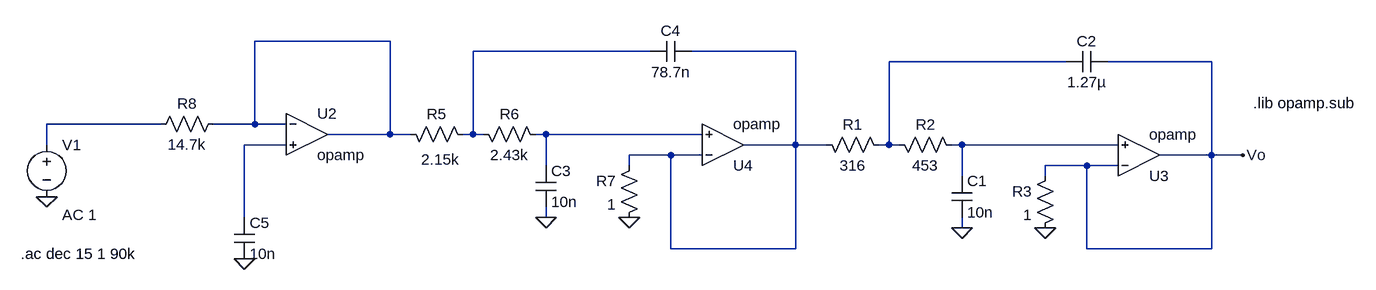
[diagram p0: schematic low_pass_filter.asc]
low_pass_filter.asc, the LTspice schematic file:
Version 4.1
SHEET 1 880 680
WIRE -672 -256 -880 -256
WIRE -272 -240 -544 -240
WIRE -48 -240 -208 -240
WIRE 368 -224 96 -224
WIRE 592 -224 432 -224
WIRE -1024 -128 -1200 -128
WIRE -880 -128 -880 -256
WIRE -880 -128 -944 -128
WIRE -832 -128 -880 -128
WIRE -672 -112 -672 -256
WIRE -672 -112 -768 -112
WIRE -640 -112 -672 -112
WIRE -544 -112 -544 -240
WIRE -544 -112 -560 -112
WIRE -528 -112 -544 -112
WIRE -432 -112 -448 -112
WIRE -192 -112 -432 -112
WIRE -1200 -96 -1200 -128
WIRE -832 -96 -896 -96
WIRE -48 -96 -48 -240
WIRE -48 -96 -128 -96
WIRE 0 -96 -48 -96
WIRE 96 -96 96 -224
WIRE 96 -96 80 -96
WIRE 112 -96 96 -96
WIRE 208 -96 192 -96
WIRE 448 -96 208 -96
WIRE -240 -80 -304 -80
WIRE -192 -80 -240 -80
WIRE 592 -80 592 -224
WIRE 592 -80 512 -80
WIRE 640 -80 592 -80
WIRE -432 -64 -432 -112
WIRE -304 -64 -304 -80
WIRE 400 -64 336 -64
WIRE 448 -64 400 -64
WIRE 208 -48 208 -96
WIRE 336 -48 336 -64
WIRE -896 16 -896 -96
WIRE -432 16 -432 0
WIRE 208 32 208 16
WIRE -240 64 -240 -80
WIRE -48 64 -48 -96
WIRE -48 64 -240 64
WIRE 400 64 400 -64
WIRE 592 64 592 -80
WIRE 592 64 400 64
FLAG 208 32 0
FLAG 336 32 0
FLAG -432 16 0
FLAG -304 16 0
FLAG -1200 -16 0
FLAG 640 -80 Vo
FLAG -896 80 0
SYMBOL res 96 -80 M270
WINDOW 0 32 56 VTop 2
WINDOW 3 0 56 VBottom 2
SYMATTR InstName R1
SYMATTR Value 316
SYMBOL res 208 -80 M270
WINDOW 0 32 56 VTop 2
WINDOW 3 0 56 VBottom 2
SYMATTR InstName R2
SYMATTR Value 453
SYMBOL res 352 -64 M0
SYMATTR InstName R3
SYMATTR Value 1
SYMBOL cap 192 16 M180
WINDOW 0 24 56 Left 2
WINDOW 3 24 8 Left 2
SYMATTR InstName C1
SYMATTR Value 10n
SYMBOL cap 432 -208 M270
WINDOW 0 32 32 VTop 2
WINDOW 3 0 32 VBottom 2
SYMATTR InstName C2
SYMATTR Value 1.27µ
SYMBOL res -544 -96 M270
WINDOW 0 32 56 VTop 2
WINDOW 3 -7 50 VBottom 2
SYMATTR InstName R5
SYMATTR Value 2.15k
SYMBOL res -432 -96 M270
WINDOW 0 32 56 VTop 2
WINDOW 3 0 56 VBottom 2
SYMATTR InstName R6
SYMATTR Value 2.43k
SYMBOL res -288 -80 M0
SYMATTR InstName R7
SYMATTR Value 1
SYMBOL cap -448 0 M180
WINDOW 0 24 56 Left 2
WINDOW 3 24 8 Left 2
SYMATTR InstName C3
SYMATTR Value 10n
SYMBOL cap -208 -224 M270
WINDOW 0 32 32 VTop 2
WINDOW 3 0 32 VBottom 2
SYMATTR InstName C4
SYMATTR Value 78.7n
SYMBOL OpAmps\\opamp 480 -16 M180
SYMATTR InstName U3
SYMBOL OpAmps\\opamp -160 -32 M180
SYMATTR InstName U4
SYMBOL voltage -1200 -112 R0
WINDOW 123 24 124 Left 2
WINDOW 39 0 0 Left 0
SYMATTR Value2 AC 1
SYMATTR InstName V1
SYMATTR Value ""
SYMBOL OpAmps\\opamp -800 -176 R0
SYMATTR InstName U2
SYMBOL res -928 -144 R90
WINDOW 0 0 56 VBottom 2
WINDOW 3 32 56 VTop 2
SYMATTR InstName R8
SYMATTR Value 14.7k
SYMBOL cap -912 16 R0
SYMATTR InstName C5
SYMATTR Value 10n
TEXT 656 -160 Left 2 !.lib opamp.sub
TEXT -1240 72 Left 2 !.ac dec 15 1 90k

The netlist it stands for:
* low_pass_filter.asc
R1 N004 N003 316
R2 N008 N004 453
R3 Vo 0 1
C1 0 N008 10n
C2 Vo N004 1.27µ
R5 N002 N001 2.15k
R6 N006 N002 2.43k
R7 N003 0 1
C3 0 N006 10n
C4 N003 N002 78.7n
X§U3 Vo N008 Vo opamp Aol=100K GBW=10Meg  ; pins invin noninvin out
X§U4 N003 N006 N003 opamp Aol=100K GBW=10Meg  ; pins invin noninvin out
V1 N005 0 AC 1
X§U2 N001 N007 N001 opamp Aol=100K GBW=10Meg  ; pins invin noninvin out
R8 N001 N005 14.7k
C5 N007 0 10n
.lib opamp.sub
.ac dec 15 1 90k
.backanno
.end